# Altium schematic sheet SHDN-CURRENT-S04-V00-PSU-3V3.SchDoc: Power Supply (9-25V to 3v3 @ 0.1-0.3A)
size A3; DrawnBy: Jonn Dillon; DocumentNumber: 8; Revision: 01; SheetNumber: 8; SheetTotal: 14; Version: 01; Project: Shutdown Current Board 2020; PageSetup: Record=PageOptions|CenterHorizontal=True|CenterVertical=True|PrintScale=0.97|XCorrection=1.00|YCorrection=1.00|PrintKind=0|BorderSize=5000000|LeftOffset=0|BottomOffset=0|Orientation=2|PaperLength=1000|PaperWidth=1000|Scale=100|PaperSource=7|PrintQuality=-4|MediaType=1|DitherType=10|PaperKind=A4|PrintScaleMode=1
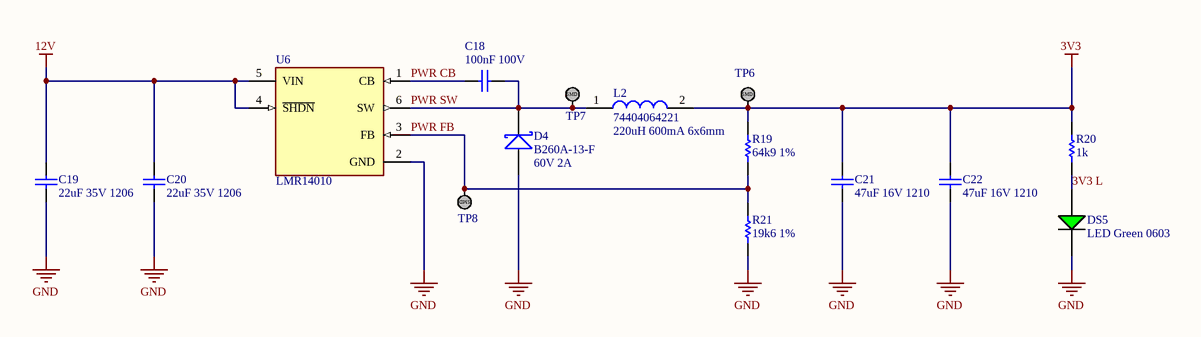
[diagram p0: SHDN-CURRENT-S04-V00-PSU-3V3.SchDoc]

## Parts
C18  100nF 100V  [Cap_Ceramic_0603]
C19  22uF 35V 1206  [Cap_Ceramic_1206]
C20  22uF 35V 1206  [Cap_Ceramic_1206]
C21  47uF 16V 1210  [Cap_Ceramic_1210]
C22  47uF 16V 1210  [Cap_Ceramic_1210]
D4  B260A-13-F  [SMA]
DS5  LED Green 0603  [LED GREEN 0603]
L2  74404064221  [Inductor_6x6mm]
R19  64k9 1%  [Res_ThinFilm_0603]
R20  1k  [Res_ThinFilm_0603]
R21  19k6 1%  [Res_ThinFilm_0603]
TP6  TestPoint_SMD  [TestPointSMD]  (value not drawn)
TP7  TestPoint_SMD  [TestPointSMD]  (value not drawn)
TP8  TestPoint_SMD  [TestPointSMD]  (value not drawn)
U6  LMR14010  [LMR14010]

## Nets
3V3: C21.2 C22.2 L2.2 R19.2 R20.2 TP6.1
12V: C19.2 C20.2 U6.4(~{SHDN}) U6.5(VIN)
GND: C19.1 C20.1 C21.1 C22.1 D4.A DS5.2(C) R21.1 U6.2(GND)
3V3 L: DS5.1(A) R20.1
PWR CB: C18.1 U6.1(CB)
PWR FB: R19.1 R21.2 TP8.1 U6.3(FB)
PWR SW: C18.2 D4.K L2.1 TP7.1 U6.6(SW)

## Notes on the sheet
- (near L2) 220uH 600mA 6x6mm
- (near D4) 60V 2A
- Revision History:
- Sheet Title:
- Rev
- Date
- Description
- Project:
- Size:
- Drawn By:
- A3
- Number:
- Revision:
- Sheet
- Version:
- of
- QUT Motorsport
- O-120, Gardens Point
- 2 George Street
- Brisbane, QLD 4000
- Australia
- Print Date:
- Print Time:
- File Name:
- (in symbol TestPoint_SMD) SMD

## Library data of the parts
C18 = 100nF 100V 5% X7R 0603: Capacitor, Ceramic, SMD, 100nF, 100V, 5%, X7R, 0603
C19 C20 = 22uF 35V 10% X7R 1206: Capacitor, Ceramic, SMD, 22uF, 35V, 10%, X7R, 1206
C21 C22 = 47uF 16V 10% X7R 1210: Capacitor, Ceramic, SMD, 47uF, 16V, 5%, X7R, 1210
D4 = B260A-13-F: Diode, Schottky Barrier Rectifier, 60 V, 2 A, B260A-13-F
L2 = 74404064221: FIXED IND 220UH 660MA 850 MOHM; ComponentLink1Description: Digikey; ComponentLink1URL: https://www.digikey.com.au/product-detail/en/w%C3%BCrth-elektronik/74404064221/732-7261-1-ND/5353241; ComponentLink2Description: LCSC A; ComponentLink2URL: https://lcsc.com/product-detail/Power-Inductors_Sunlord-SWPA6045S221MT_C91047.html; ComponentLink3Description: LCSC B; ComponentLink3URL: https://lcsc.com/product-detail/Power-Inductors_SXN-Shun-Xiang-Nuo-Elec-SMNR6045-221MT_C467145.html
R19 = 64k9 1% 0603: Resistor, SMD, 64k9, 0.1W, 5%, 0603
R20 = 1k 5% 0603: Resistor, SMD, 1k, 0.1W, 5%, 0603
R21 = 19k6 1% 0603: Resistor, SMD, 19k6, 0.1W, 5%, 0603